# EAGLE design shield-v1.2 (EAGLE 8.2.0)
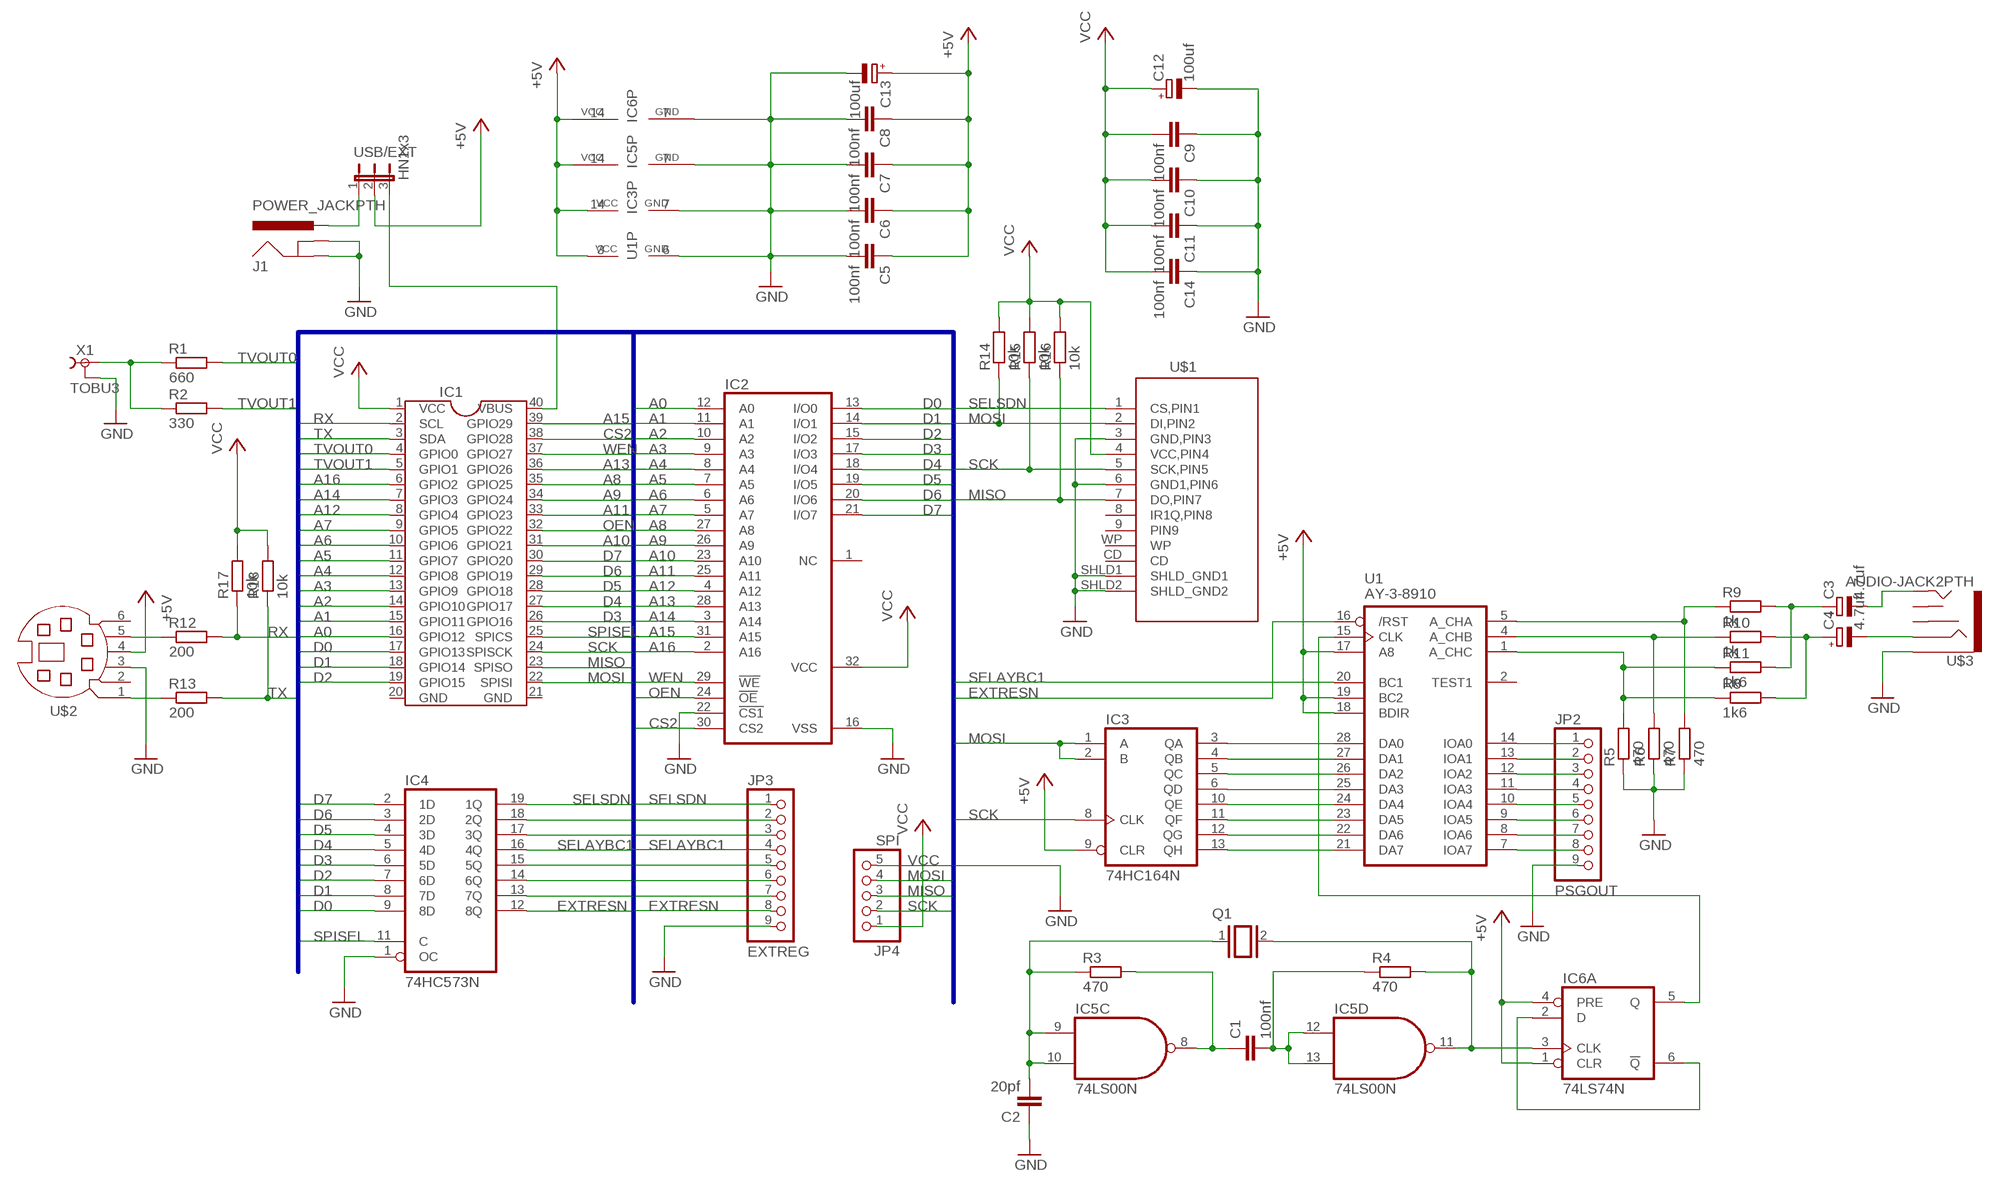
[diagram p0: schematic, sheet 1]

## Parts
C1  100nf  CAP1206  [1206]
C2  20pf  CAP1206  [1206]
C3  4.7uf  CPOL-EUE5-5  [E5-5]
C4  4.7uf  CPOL-EUE5-5  [E5-5]
C5  100nf  CAP1206  [1206]
C6  100nf  CAP1206  [1206]
C7  100nf  CAP1206  [1206]
C8  100nf  CAP1206  [1206]
C9  100nf  CAP1206  [1206]
C10  100nf  CAP1206  [1206]
C11  100nf  CAP1206  [1206]
C12  100uf  CPOL-EUE5-5  [E5-5]
C13  100uf  CPOL-EUE5-5  [E5-5]
C14  100nf  CAP1206  [1206]
IC1  STEPFPGA  [DIL40]
IC2  628128P  [DIL32]
IC3  74HC164N  [DIL14]
IC4  74HC573N  [DIL20]
IC5  74LS00N  [DIL14]
IC6  74LS74N  [DIL14]
J1  POWER_JACKPTH  [POWER_JACK_PTH]
JP2  PSGOUT  PINHD-1X9  [1X09]
JP3  EXTREG  PINHD-1X9  [1X09]
JP4  SPI  PINHD-1X5  [1X05]
Q1  XTAL/S  [QS]
R1  660  R-EU_R1206  [R1206]
R2  330  R-EU_R1206  [R1206]
R3  470  R-EU_R1206  [R1206]
R4  470  R-EU_R1206  [R1206]
R5  470  R-EU_R1206  [R1206]
R6  470  R-EU_R1206  [R1206]
R7  470  R-EU_R1206  [R1206]
R8  1k6  R-EU_R1206  [R1206]
R9  1k  R-EU_R1206  [R1206]
R10  1k  R-EU_R1206  [R1206]
R11  1k6  R-EU_R1206  [R1206]
R12  200  R-EU_R1206  [R1206]
R13  200  R-EU_R1206  [R1206]
R14  10k  R-EU_R1206  [R1206]
R15  10k  R-EU_R1206  [R1206]
R16  10k  R-EU_R1206  [R1206]
R17  10k  R-EU_R1206  [R1206]
R18  10k  R-EU_R1206  [R1206]
U1  AY-3-8910  [DIL28-6]
U$1  FCI_SD_SOCKET  [SD-MMC_SOCKET-PP]
U$2  MD06SS  [MDIN06SS]
U$3  AUDIO-JACK2PTH  [AUDIO-JACK]
USB/EXT  HN1x3  JP2E  [JP2]
X1  TOBU3  [TOBU3]

## Nets
+5V: C5.1 C6.1 C7.1 C8.1 C13.+ IC3.9(CLR) IC3.14(VCC) IC5.14(P:VCC) IC6.1(A:CLR) IC6.4(A:PRE) IC6.14(P:VCC) U1.3(VCC) U1.17(A8) U1.18(BDIR) U1.19(BC2) U$2.4 USB/EXT.2
A0: IC1.16(GPIO12) IC2.12(A0)
A1: IC1.15(GPIO11) IC2.11(A1)
A2: IC1.14(GPIO10) IC2.10(A2)
A3: IC1.13(GPIO9) IC2.9(A3)
A4: IC1.12(GPIO8) IC2.8(A4)
A5: IC1.11(GPIO7) IC2.7(A5)
A6: IC1.10(GPIO6) IC2.6(A6)
A7: IC1.9(GPIO5) IC2.5(A7)
A8: IC1.35(GPIO25) IC2.27(A8)
A9: IC1.34(GPIO24) IC2.26(A9)
A10: IC1.31(GPIO21) IC2.23(A10)
A11: IC1.33(GPIO23) IC2.25(A11)
A12: IC1.8(GPIO4) IC2.4(A12)
A13: IC1.36(GPIO26) IC2.28(A13)
A14: IC1.7(GPIO3) IC2.3(A14)
A15: IC1.39(GPIO29) IC2.31(A15)
A16: IC1.6(GPIO2) IC2.2(A16)
CS2: IC1.38(GPIO28) IC2.30(CS2)
D0: IC1.17(GPIO13) IC2.13(I/O0) IC4.9(8D)
D1: IC1.18(GPIO14) IC2.14(I/O1) IC4.8(7D)
D2: IC1.19(GPIO15) IC2.15(I/O2) IC4.7(6D)
D3: IC1.26(GPIO16) IC2.17(I/O3) IC4.6(5D)
D4: IC1.27(GPIO17) IC2.18(I/O4) IC4.5(4D)
D5: IC1.28(GPIO18) IC2.19(I/O5) IC4.4(3D)
D6: IC1.29(GPIO19) IC2.20(I/O6) IC4.3(2D)
D7: IC1.30(GPIO20) IC2.21(I/O7) IC4.2(1D)
EXTRESN: IC4.12(8Q) JP3.8 U1.16(/RST)
GND: C2.1 C5.2 C6.2 C7.2 C8.2 C9.1 C10.1 C11.1 C12.- C13.- C14.1 IC2.16(VSS) IC2.22(!CS1) IC3.7(GND) IC4.1(OC) IC5.7(P:GND) IC6.7(P:GND) J1.GND J1.GNDBREAK JP2.9 JP3.9 JP4.5 R5.1 R6.1 R7.1 U1.6(GND) U$1.3(GND,PIN3) U$1.6(GND1,PIN6) U$1.SHLD1(SHLD_GND1) U$1.SHLD2(SHLD_GND2) U$2.3 U$3.SLEEVE X1.2 X1.2@1 X1.2@2
MISO: IC1.23(SPISO) JP4.3 R16.1 U$1.7(DO,PIN7)
MOSI: IC1.22(SPISI) IC3.1(A) IC3.2(B) JP4.4 R14.1 U$1.2(DI,PIN2)
N$1: R1.1 R2.1 X1.1
N$2: IC3.3(QA) U1.28(DA0)
N$3: IC3.4(QB) U1.27(DA1)
N$4: IC3.5(QC) U1.26(DA2)
N$5: IC3.6(QD) U1.25(DA3)
N$6: IC3.10(QE) U1.24(DA4)
N$7: IC3.11(QF) U1.23(DA5)
N$8: IC3.12(QG) U1.22(DA6)
N$9: IC3.13(QH) U1.21(DA7)
N$10: R5.2 R8.1 R11.1 U1.1(A_CHC)
N$11: C1.1 IC5.8(C:O) R3.2
N$12: C1.2 IC5.12(D:I0) IC5.13(D:I1) R4.1
N$13: C2.2 IC5.9(C:I0) IC5.10(C:I1) Q1.1 R3.1
N$14: IC5.11(D:O) IC6.3(A:CLK) Q1.2 R4.2
N$15: R6.2 R10.1 U1.4(A_CHB)
N$16: IC6.2(A:D) IC6.6(A:!Q)
N$17: IC6.5(A:Q) U1.15(CLK)
N$18: R7.2 R9.1 U1.5(A_CHA)
N$19: C4.+ R8.2 R10.2
N$20: C3.+ R9.2 R11.2
N$21: C3.- U$3.TIP
N$22: C4.- U$3.RING
N$23: R12.1 U$2.5
N$24: R13.1 U$2.1
N$25: JP2.1 U1.14(IOA0)
N$26: JP2.2 U1.13(IOA1)
N$27: JP2.3 U1.12(IOA2)
N$28: JP2.4 U1.11(IOA3)
N$29: JP2.5 U1.10(IOA4)
N$30: JP2.6 U1.9(IOA5)
N$31: JP2.7 U1.8(IOA6)
N$32: JP2.8 U1.7(IOA7)
N$33: IC4.18(2Q) JP3.2
N$34: IC4.17(3Q) JP3.3
N$35: IC4.15(5Q) JP3.5
N$36: IC4.14(6Q) JP3.6
N$37: IC4.13(7Q) JP3.7
N$38: J1.PWR USB/EXT.1
N$39: IC1.40(VBUS) USB/EXT.3
OEN: IC1.32(GPIO22) IC2.24(!OE)
RX: IC1.2(SCL) R12.2 R17.1
SCK: IC1.24(SPISCK) IC3.8(CLK) JP4.2 R15.1 U$1.5(SCK,PIN5)
SELAYBC1: IC4.16(4Q) JP3.4 U1.20(BC1)
SELSDN: IC4.19(1Q) JP3.1 U$1.1(CS,PIN1)
SPISEL: IC1.25(SPICS) IC4.11(C)
TVOUT0: IC1.4(GPIO0) R1.2
TVOUT1: IC1.5(GPIO1) R2.2
TX: IC1.3(SDA) R13.2 R18.1
VCC: C9.2 C10.2 C11.2 C12.+ C14.2 IC1.1(VCC) IC2.32(VCC) JP4.1 R14.2 R15.2 R16.2 R17.2 R18.2 U$1.4(VCC,PIN4)
WEN: IC1.37(GPIO27) IC2.29(!WE)
Unconnected: IC2.1(NC) IC5.1(A:I0) IC5.2(A:I1) IC5.3(A:O) IC5.4(B:I0) IC5.5(B:I1) IC5.6(B:O) IC6.8(B:!Q) IC6.9(B:Q) IC6.10(B:PRE) IC6.11(B:CLK) IC6.12(B:D) IC6.13(B:CLR) U1.2(TEST1) U$1.8(IR1Q,PIN8) U$1.9(PIN9) U$1.CD U$1.WP U$2.2 U$2.6 U$3.RSH U$3.TSH

## Buses
A[0..16],D[0..7],WEN,OEN,CS2,RX,TX,TVOUT[0..1],SPISEL,MISO,MOSI,SCK,SELSDN,SELAYBC1,EXTRESN

## Power pins joined to a net without a drawn wire
GND: IC1.20(GND) IC1.21(GND) IC4.10(GND)
VCC: IC4.20(VCC)

## Library data of the parts
C1 C2 C5-C11 C14 = SparkFun:CAP: Capacitor Standard 0603 ceramic capacitor, and 0.1" leaded capacitor.
C3 C4 C12 C13 = rcl:CPOL-EU: POLARIZED CAPACITOR, European symbol
IC1 = stepfpga:STEPFPGA: StepFPGA module
IC2 = memory-hitachi:628128P: MEMORY; OC_FARNELL: unknown; OC_NEWARK: unknown
IC3 = 74xx-eu:74*164: 8-bit parallel out SHIFT REGISTER
IC4 = 74xx-eu:74*573: 8-bit D latch BUS DRIVER
IC5 = 74xx-us:74*00: Quad 2-input NAND gate
IC6 = 74xx-us:74*74: Dual D type positive edge triggered FLIP FLOP, preset and clear
J1 = SparkFun:POWER_JACK: Power Jack This is the standard 5.5mm barrel jack for power. The PTH is the most common, proven, reliable, footprint. All others are experimental. The Slot footprint only works if the mill layer is transmitted to the PCB fab house so be warned. Spark Fun Electronics SKU : PRT-00119. Mating wall wart : TOL-00298 (and others)
JP2 JP3 = pinhead:PINHD-1X9: PIN HEADER
JP4 = pinhead:PINHD-1X5: PIN HEADER
Q1 = special:XTAL/S: CRYSTAL
R1-R18 = resistor:R-EU_: RESISTOR, European symbol
U1 = oldchips:AY-3-8910: Programmable sound generator
U$1 = stepfpga:FCI_SD_SOCKET: FCI Memory Card Connector (SD card); MF: FCI; MOUSER: 649-10067847-001RLF; MPN: 10067847-001RLF
U$2 = con-yamaichi:MD06SS: YAMAICHI CONNECTOR; OC_FARNELL: unknown; OC_NEWARK: unknown
U$3 = SparkFun:AUDIO-JACK2
USB/EXT = jumper:JP2E: JUMPER
X1 = con-hirschmann:TOBU3: Female Cinch CONNECTOR ( RCA Jack ); MF: FARNELL; MPN: TOBU 3; OC_FARNELL: 592791; OC_NEWARK: 06WX5914

## Board
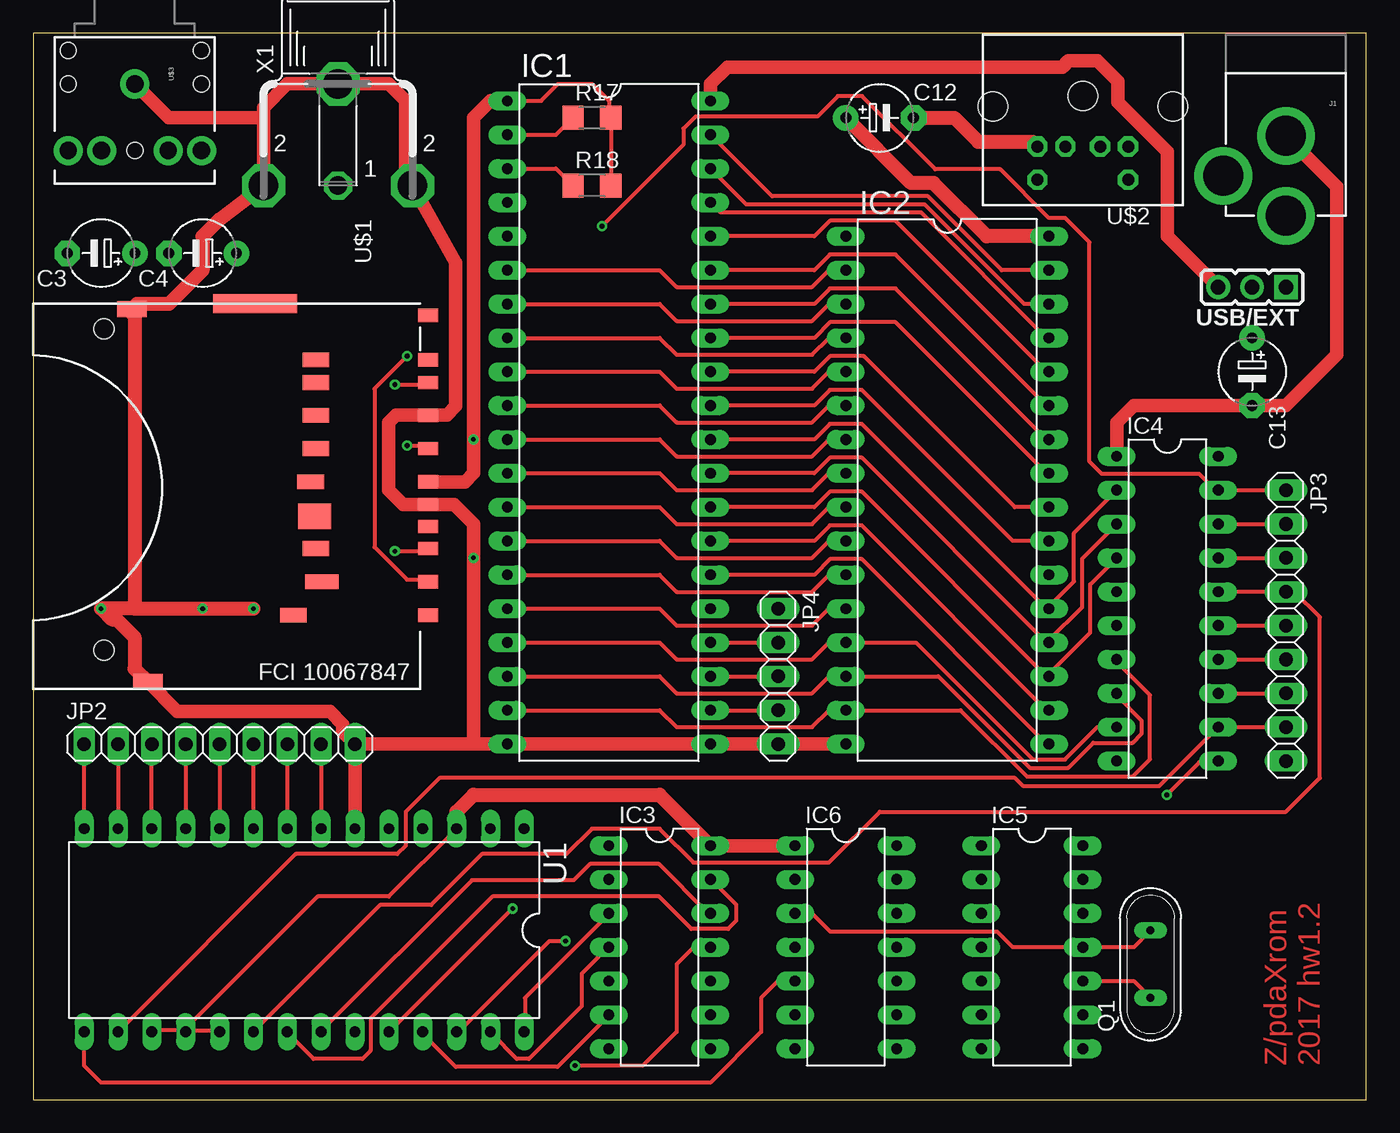
[diagram p1: board, top side]
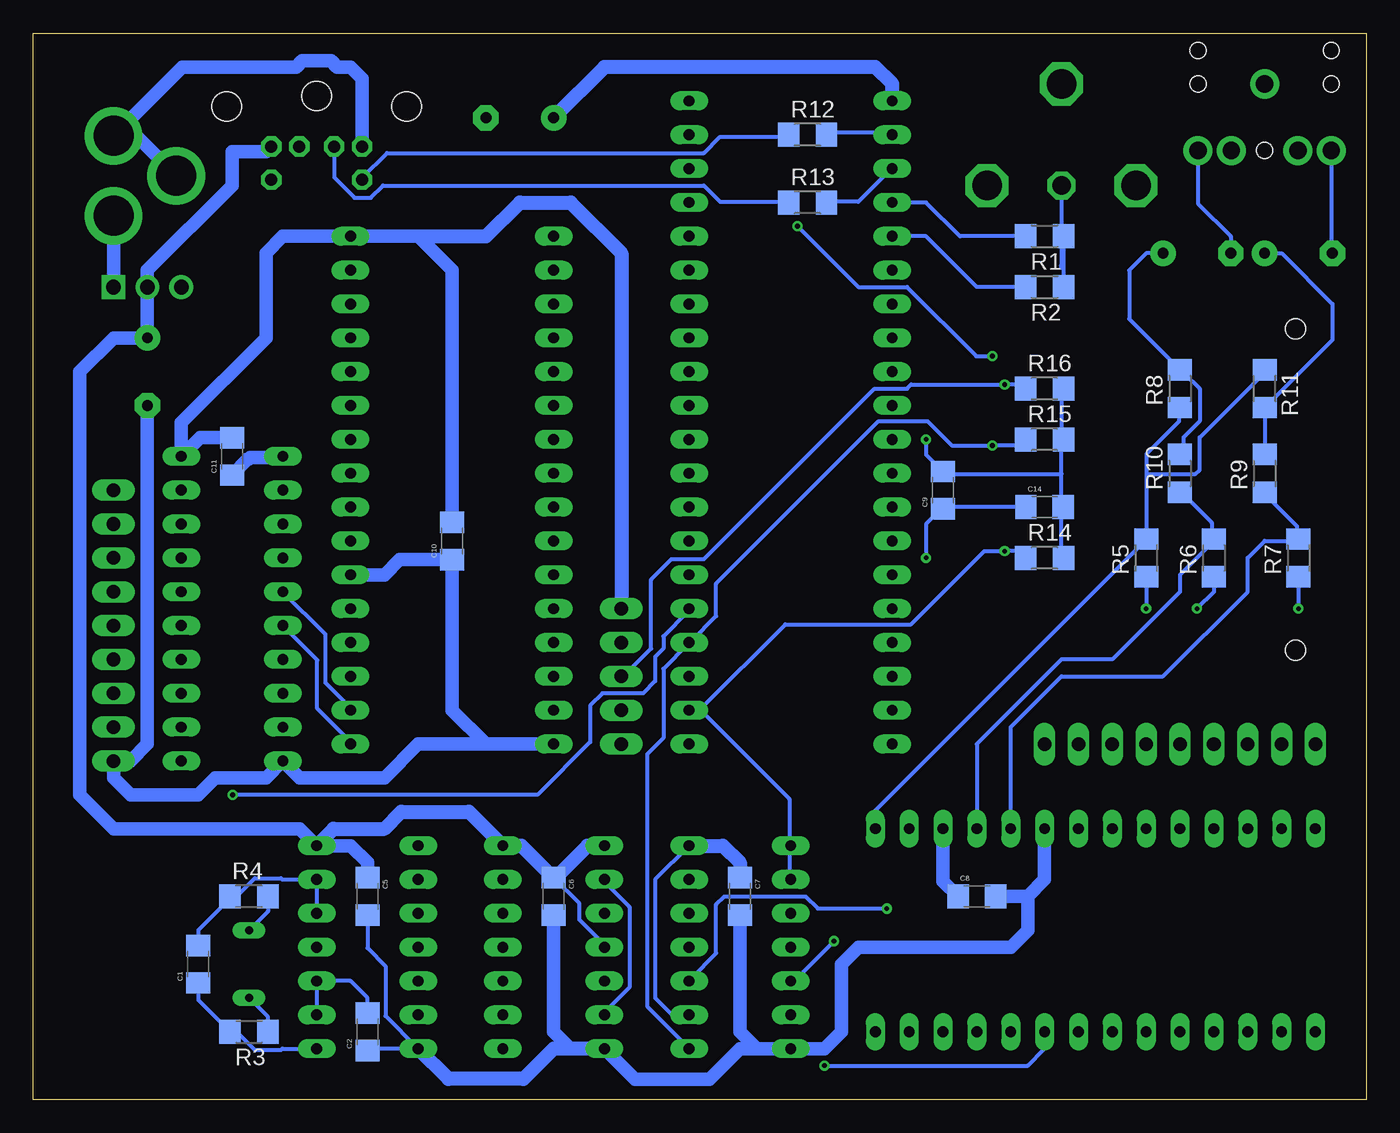
[diagram p2: board, bottom side, seen from below]

Size 100 x 80 mm. Coordinates in mm from the lower left corner, seen from the top.
Outline: 0,0 100,0 100,80 0,80 0,0
Copper layers (1*16): Top 0.035mm / dielectric 1.5mm / Bottom 0.035mm
Design rules "default *": minimum track width 12mil, minimum drill 0.35mm, track to track 12mil, track to pad 12mil, pad to pad 12mil, via to via 12mil, smd to smd 12mil, copper to edge 40mil, drill to drill 12mil, minimum pad ring 12mil, minimum via ring 8mil, stop-mask expansion 4mil, vias tented up to drill 0mil, thermal gap 10mil

### Footprints (pad centres in the part's own frame; a part is rotated, then mirrored left to right if it is on the bottom)
1206 = smd 1.6 x 1.8: 1 -1.4,0; 2 1.4,0
E5-5 = drill 0.813 pad 1.905: + -2.54,0 | drill 0.813 pad 1.905 octagon: - 2.54,0
DIL40 = drill 0.813 long: 1 -24.13,-7.62; 2 -21.59,-7.62; 3 -19.05,-7.62; 4 -16.51,-7.62; 5 -13.97,-7.62; 6 -11.43,-7.62; 7 -8.89,-7.62; 8 -6.35,-7.62; 9 -3.81,-7.62; 10 -1.27,-7.62; 11 1.27,-7.62; 12 3.81,-7.62; 13 6.35,-7.62; 14 8.89,-7.62; 15 11.43,-7.62; 16 13.97,-7.62; 17 16.51,-7.62; 18 19.05,-7.62; 19 21.59,-7.62; 20 24.13,-7.62; 21 24.13,7.62; 22 21.59,7.62; 23 19.05,7.62; 24 16.51,7.62; 25 13.97,7.62; 26 11.43,7.62; 27 8.89,7.62; 28 6.35,7.62; 29 3.81,7.62; 30 1.27,7.62; 31 -1.27,7.62; 32 -3.81,7.62; 33 -6.35,7.62; 34 -8.89,7.62; 35 -11.43,7.62; 36 -13.97,7.62; 37 -16.51,7.62; 38 -19.05,7.62; 39 -21.59,7.62; 40 -24.13,7.62
DIL32 = drill 0.813 long: 1 -19.05,-7.62; 2 -16.51,-7.62; 3 -13.97,-7.62; 4 -11.43,-7.62; 5 -8.89,-7.62; 6 -6.35,-7.62; 7 -3.81,-7.62; 8 -1.27,-7.62; 9 1.27,-7.62; 10 3.81,-7.62; 11 6.35,-7.62; 12 8.89,-7.62; 13 11.43,-7.62; 14 13.97,-7.62; 15 16.51,-7.62; 16 19.05,-7.62; 17 19.05,7.62; 18 16.51,7.62; 19 13.97,7.62; 20 11.43,7.62; 21 8.89,7.62; 22 6.35,7.62; 23 3.81,7.62; 24 1.27,7.62; 25 -1.27,7.62; 26 -3.81,7.62; 27 -6.35,7.62; 28 -8.89,7.62; 29 -11.43,7.62; 30 -13.97,7.62; 31 -16.51,7.62; 32 -19.05,7.62
DIL14 = drill 0.813 long: 1 -7.62,-3.81; 2 -5.08,-3.81; 3 -2.54,-3.81; 4 0,-3.81; 5 2.54,-3.81; 6 5.08,-3.81; 7 7.62,-3.81; 8 7.62,3.81; 9 5.08,3.81; 10 2.54,3.81; 11 0,3.81; 12 -2.54,3.81; 13 -5.08,3.81; 14 -7.62,3.81
DIL20 = drill 0.813 long: 1 -11.43,-3.81; 2 -8.89,-3.81; 3 -6.35,-3.81; 4 -3.81,-3.81; 5 -1.27,-3.81; 6 1.27,-3.81; 7 3.81,-3.81; 8 6.35,-3.81; 9 8.89,-3.81; 10 11.43,-3.81; 11 11.43,3.81; 12 8.89,3.81; 13 6.35,3.81; 14 3.81,3.81; 15 1.27,3.81; 16 -1.27,3.81; 17 -3.81,3.81; 18 -6.35,3.81; 19 -8.89,3.81; 20 -11.43,3.81
POWER_JACK_PTH = drill 2.997 pad 4.318: GND 0,7.7; GNDBREAK 4.7,10.7; PWR 0,13.7
1X09 = drill 1.016 long: 1 -10.16,0; 2 -7.62,0; 3 -5.08,0; 4 -2.54,0; 5 0,0; 6 2.54,0; 7 5.08,0; 8 7.62,0; 9 10.16,0
1X05 = drill 1.016 long: 1 -5.08,0; 2 -2.54,0; 3 0,0; 4 2.54,0; 5 5.08,0
QS = drill 0.61 long: 1 -2.54,0; 2 2.54,0
R1206 = smd 1.6 x 1.803: 1 -1.422,0; 2 1.422,0
DIL28-6 = drill 0.813 long: 1 -16.51,-7.62; 2 -13.97,-7.62; 3 -11.43,-7.62; 4 -8.89,-7.62; 5 -6.35,-7.62; 6 -3.81,-7.62; 7 -1.27,-7.62; 8 1.27,-7.62; 9 3.81,-7.62; 10 6.35,-7.62; 11 8.89,-7.62; 12 11.43,-7.62; 13 13.97,-7.62; 14 16.51,-7.62; 15 16.51,7.62; 16 13.97,7.62; 17 11.43,7.62; 18 8.89,7.62; 19 6.35,7.62; 20 3.81,7.62; 21 1.27,7.62; 22 -1.27,7.62; 23 -3.81,7.62; 24 -6.35,7.62; 25 -8.89,7.62; 26 -11.43,7.62; 27 -13.97,7.62; 28 -16.51,7.62
SD-MMC_SOCKET-PP = smd 1 x 1.5: 1 6.875,29.6; 2 4.375,29.6; 3 1.075,29.6; 4 -0.625,29.6; 5 -3.125,29.6; 6 -5.625,29.6; 7 -8.075,29.6; 8 -9.775,29.6; 9 9.375,29.6; CD 2.725,29.6; WP -13.125,29.6 | smd 1.4 x 6.3: 14 -14,16.65 | smd 1.2 x 2.2: SHLD1 -13.6,7.4; SHLD2 14.4,8.6 | smd 1.1 x 2: SW -9.775,21.2; SW1 -8.075,21.2; SW2 -5.625,21.2; SW3 -3.125,21.2; SW4 -0.625,20.8; SW6 4.375,21.2; SW8 9.375,19.5 | smd 1.9 x 2.5: SW5 1.95,21.1 | smd 1.1 x 2.5: SW7 6.875,21.65 | hole 1.5: -12.1,5.3; 12,5.3
MDIN06SS = drill 0.9 octagon: 1 1.3,8.5; 2 -1.3,8.5; 3 3.4,8.5; 4 -3.4,8.5; 5 3.4,11; 6 -3.4,11 | hole 2.2: -6.75,5.5; 0,4.7; 6.75,5.5
AUDIO-JACK = drill 1.3 pad 2.184: RING 5,5; RSH 5,2.5; SLEEVE 0,0; TIP 5,-5; TSH 5,-2.5 | hole 1.2: 0,5; -2.5,5; -2.5,-5; 0,-5; 5,0
JP2 = drill 1.1 pad 1.778 square: 1 -2.54,0 | drill 1.1 pad 1.778: 2 0,0; 3 2.54,0
TOBU3 = drill 1.397 octagon: 1 0,-2.54 | drill 2.21 octagon: 2 5.588,-2.54; 2@1 -5.588,-2.54; 2@2 0,5.08

### Placement (x,y rotation side)
C1  87.63,10.16 90 bottom
C2  74.93,5.08 90 bottom
C3  5.08,63.5 180 top
C4  12.7,63.5 180 top
C5  74.93,15.24 270 bottom
C6  60.96,15.24 270 bottom
C7  46.99,15.24 270 bottom
C8  29.21,15.24 0 bottom
C9  31.75,45.72 90 bottom
C10  68.58,41.91 90 bottom
C11  85.09,48.26 90 bottom
C12  63.5,73.66 0 top
C13  91.44,54.61 270 top
C14  24.13,44.45 0 bottom
IC1  43.18,50.8 270 top
IC2  68.58,45.72 270 top
IC3  46.99,11.43 270 top
IC4  85.09,36.83 270 top
IC5  74.93,11.43 270 top
IC6  60.96,11.43 270 top
J1  93.98,80.01 180 top
JP2  13.97,26.67 0 top
JP3  93.98,35.56 270 top
JP4  55.88,31.75 270 top
Q1  83.82,10.16 90 top
R1  24.13,64.77 180 bottom
R2  24.13,60.96 180 bottom
R3  83.82,5.08 180 bottom
R4  83.82,15.24 0 bottom
R5  16.51,40.64 90 bottom
R6  11.43,40.64 90 bottom
R7  5.08,40.64 90 bottom
R8  13.97,53.34 90 bottom
R9  7.62,46.99 90 bottom
R10  13.97,46.99 90 bottom
R11  7.62,53.34 270 bottom
R12  41.91,72.39 0 bottom
R13  41.91,67.31 0 bottom
R14  24.13,40.64 0 bottom
R15  24.13,49.53 0 bottom
R16  24.13,53.34 0 bottom
R17  41.91,73.66 0 top
R18  41.91,68.58 0 top
U1  20.32,12.7 180 top
U$1  0,45.72 270 top
U$2  78.74,80.01 180 top
U$3  7.62,76.2 270 top
USB/EXT  91.44,60.96 180 top
X1  22.86,71.12 0 top

### Tracks (layer width: path | path; a pad name or v marks a point on that pad's centre or on a via)
+5V
  Top 0.305: 11.28,5.18 9.14,5.18 U1.17 | 11.28,5.18 U1.18 11.58,5.18 13.72,5.18 U1.19 | U1.3 26.67,15.24 21.34,15.24 11.28,5.18
  Top 1.016: IC3.14 IC6.1
  Top 1.067: U1.3 31.75,21.59 33.02,22.86 46.99,22.86 IC3.14
  Bottom 0.305: IC6.4 57.15,11.61 59.03,13.49 59.03,14.71 C6.1 | IC3.14 53.34,16.51 53.34,7.62 52.07,6.35 IC3.9
  Bottom 1.016: U1.3 31.75,16.38 C8.1 | C5.1 74.93,17.78 76.2,19.05 IC5.14 80.01,20.32 93.98,20.32 96.52,22.86 96.52,54.61 93.98,57.15 C13.+ USB/EXT.2 91.44,62.23 85.09,68.58 85.09,71.12 82.53,71.12 U$2.4
  Bottom 1.067: IC5.14 77.47,20.32 73.66,20.32 72.39,21.59 67.31,21.59 IC6.14 63.37,19.05 C6.1 60.83,16.64 58.42,19.05 IC6.1 | IC3.14 48.26,19.05 46.99,17.78 C7.1
A0
  Top 0.305: IC1.16 46.99,36.83 48.26,35.56 58.42,35.56 59.69,36.83 IC2.12
A1
  Top 0.305: IC1.15 46.99,39.37 48.26,38.1 58.42,38.1 59.69,39.37 IC2.11
A2
  Top 0.305: IC1.14 46.99,41.91 48.26,40.64 58.42,40.64 59.69,41.91 IC2.10
A3
  Top 0.305: IC1.13 46.99,44.45 48.26,43.18 58.42,43.18 59.69,44.45 IC2.9
A4
  Top 0.305: IC1.12 46.99,46.99 48.26,45.72 58.42,45.72 59.69,46.99 IC2.8
A5
  Top 0.305: IC1.11 46.99,49.53 48.26,48.26 58.42,48.26 59.69,49.53 IC2.7
A6
  Top 0.305: IC1.10 46.99,52.07 48.26,50.8 58.42,50.8 59.69,52.07 IC2.6
A7
  Top 0.305: IC1.9 46.99,54.61 48.26,53.34 58.42,53.34 59.69,54.61 IC2.5
A8
  Top 0.305: IC1.35 58.6,62.23 59.77,63.4 64.69,63.4 76.02,52.07 IC2.27
A9
  Top 0.305: IC1.34 58.6,59.69 59.77,60.86 64.69,60.86 76.02,49.53 IC2.26
A10
  Top 0.305: IC2.23 73.48,41.91 62.16,53.24 59.77,53.24 58.6,52.07 IC1.31
A11
  Top 0.305: IC1.33 58.6,57.15 59.77,58.32 64.69,58.32 76.02,46.99 IC2.25
A12
  Top 0.305: IC1.8 46.99,57.15 48.26,55.88 58.42,55.88 59.69,57.15 IC2.4
A13
  Top 0.305: IC1.36 58.6,64.77 59.77,65.94 64.69,65.94 76.02,54.61 IC2.28
A14
  Top 0.305: IC1.7 46.99,59.69 48.26,58.42 58.42,58.42 59.69,59.69 IC2.3
A15
  Top 0.305: IC2.31 72.67,62.23 67.13,67.77 55.42,67.77 IC1.39
A16
  Top 0.305: IC1.6 46.99,62.23 48.26,60.96 58.42,60.96 59.69,62.23 IC2.2
CS2
  Top 0.305: IC2.30 74.35,59.69 66.88,67.16 53.49,67.16 IC1.38
D0
  Top 0.305: IC1.17 46.99,34.29 48.26,33.02 58.42,33.02 59.69,34.29 IC2.13 66.22,34.29 75,25.5 77.39,25.5 79.83,27.94 IC4.9
D1
  Top 0.305: IC1.18 46.99,31.75 48.26,30.48 58.42,30.48 59.69,31.75 IC2.14 67.89,31.75 74.75,24.89 77.65,24.89 79.53,26.77 82.47,26.77 83.16,27.46 83.16,28.42 81.28,30.3 IC4.8
D2
  Top 0.305: IC1.19 46.99,29.21 48.26,27.94 58.42,27.94 59.69,29.21 IC2.15 69.57,29.21 74.55,24.23 82.47,24.23 83.77,25.53 83.77,30.35 81.28,32.84 IC4.7
D3
  Top 0.305: IC1.26 58.6,39.37 59.77,40.54 62.16,40.54 76.02,26.67 IC2.17
  Bottom 0.305: IC4.6 78.69,32.97 78.69,29.34 76.2,26.85 IC2.17
D4
  Top 0.305: IC1.27 58.6,41.91 59.77,43.08 62.16,43.08 76.02,29.21 IC2.18
  Bottom 0.305: IC2.18 76.2,29.39 78.08,31.27 78.08,34.9 IC4.5
D5
  Top 0.305: IC1.28 58.6,44.45 59.77,45.62 62.16,45.62 76.02,31.75 IC2.19 76.2,31.93 79.3,35.02 79.3,38.66 IC4.4
D6
  Top 0.305: IC1.29 58.6,46.99 59.77,48.16 62.16,48.16 76.02,34.29 IC2.20 76.2,34.47 78.69,36.96 78.69,40.59 IC4.3
D7
  Top 0.305: IC1.30 58.6,49.53 59.77,50.7 62.16,50.7 76.02,36.83 IC2.21 76.2,37.01 78.08,38.89 78.08,42.52 IC4.2
EXTRESN
  Top 0.305: U1.16 19.68,18.41 27.3,18.41 27.94,19.05 27.94,21.59 30.48,24.13 73.66,24.13 74.3,23.5 84.45,23.5 IC4.12 JP3.8
GND  (via drill 0.35)
  Top 0.305: U$1.SHLD1 7.62,58.83
  Top 1.016: U1.6 JP2.9 | 33.02,26.67 JP2.9 | 33.02,26.67 IC1.20 IC1.21 JP4.5 IC2.16 | J1.GND 97.79,68.5 97.79,55.88 93.98,52.07 C13.- 82.55,52.07 81.28,50.8 IC4.1 | U$1.SHLD2 10.81,29.11 22.26,29.11 23.22,28.16 23.22,27.58 JP2.9 | 33.02,26.67 v33.02,40.64 33.02,43.18 31.55,44.65 U$1.3 27.75,44.65 26.67,45.72 26.67,50.8 27.21,51.34 U$1.6 31.02,51.34 31.7,52.02 31.7,62.79 X1.2 27.94,69.09 27.94,74.93 26.67,76.2 X1.2@2 19.05,76.2 17.27,74.42 17.27,73.66 | 17.27,73.66 X1.2@1 | U$3.SLEEVE 10.16,73.66 17.27,73.66
  Top 1.067: C12.- 69.09,73.66 70.89,71.86 74.99,71.86 U$2.3 | v16.51,36.83 v12.7,36.83 7.62,36.83 | 7.62,36.83 v5.08,36.83 5.89,36.02 6.25,36.02 7.6,34.67 7.6,32.32 U$1.SHLD2 | 7.62,36.83 7.6,36.85 7.6,58.77 7.4,58.97 U$1.SHLD1 7.77,59.69 10.16,59.69 12.7,62.23 12.7,64.77 13.97,66.04 X1.2@1
  Bottom 0.305: C5.2 74.93,11.37 73.57,10.01 73.57,6.26 IC5.7 74.8,3.81 C2.1 | v33.02,40.64 33.02,43.18 31.88,44.32 C9.1 31.7,44.5 25.6,44.5 C14.1 | R7.1 v5.08,36.83 | R6.1 11.43,38.1 v12.7,36.83 | R5.1 v16.51,36.83
  Bottom 1.016: U1.6 24.13,16.51 25.4,15.24 | 25.4,15.24 C8.2 | C6.2 60.96,5.08 59.69,3.81 IC6.7 54.86,1.52 49.28,1.52 46.99,3.81 IC3.7 | IC3.7 40.64,3.81 39.37,5.08 39.37,10.16 38.1,11.43 26.67,11.43 25.4,12.7 25.4,15.24 | IC2.16 66.04,26.67 | 66.04,26.67 68.58,29.21 C10.1 72.52,40.51 73.66,39.37 IC2.22 | 66.04,26.67 71.12,26.67 73.66,24.13 80.01,24.13 IC4.10 82.55,24.13 86.36,24.13 87.63,22.86 92.71,22.86 93.98,24.13 JP3.9 92.71,25.4 91.44,26.67 C13.- | IC3.7 45.72,3.81 46.99,5.08 C7.2 | U$2.3 75.34,76.61 76.2,77.47 77.19,77.47 77.65,77.93 79.83,77.93 80.29,77.47 88.82,77.47 J1.GND 92.28,72.31 J1.GNDBREAK | C11.1 83.9,48.05 83.85,48.05 83.73,48.17 81.37,48.17 IC4.1
  Bottom 1.067: IC6.7 60.96,3.81 63.22,1.55 68.86,1.55 IC5.7
MISO  (via drill 0.35)
  Top 0.305: IC1.23 JP4.3 | v27.13,53.65 29.57,53.65 U$1.7
  Bottom 0.305: R16.1 25.6,53.34 25.91,53.65 v27.13,53.65 34.14,53.65 34.44,53.34 36.88,53.34 49.68,40.54 52.12,40.54 53.65,39.01 53.65,33.83 55.78,31.7 JP4.3
MOSI  (via drill 0.35)
  Top 0.305: IC1.22 JP4.4 | v27.13,41.15 29.57,41.15 U$1.2
  Bottom 0.305: IC3.2 43.28,16.76 43.28,18.9 IC3.1 43.28,19.2 43.28,22.55 49.99,29.26 | R14.1 25.6,40.84 25.91,41.15 v27.13,41.15 28.65,41.15 34.14,35.66 43.59,35.66 49.99,29.26 | 49.99,29.26 50.6,29.26 IC1.22 49.99,29.26
N$1
  Bottom 0.305: X1.1 22.86,62.38 R1.1 R2.1
N$2
  Top 0.305: U1.28 36.88,5.18 36.88,7.62 42.98,13.72 IC3.3
N$3
  Top 0.305: U1.27 34.44,4.88 36.27,3.05 37.19,3.05 41.15,7.01 41.15,9.45 42.98,11.28 IC3.4
N$4  (via drill 0.35)
  Top 0.305: v39.93,11.89 38.71,11.89 32,5.18 U1.26
  Bottom 0.305: v39.93,11.89 42.98,8.84 IC3.5
N$5
  Top 0.305: U1.25 29.26,4.88 31.7,2.44 39.32,2.44 42.98,6.1 IC3.6
N$6  (via drill 0.35)
  Top 0.305: v35.97,14.33 26.82,5.18 U1.24
  Bottom 0.305: v35.97,14.33 41.15,14.33 42.06,15.24 48.16,15.24 48.77,14.63 48.77,10.97 50.6,9.14 IC3.10
N$7  (via drill 0.35)
  Top 0.305: IC3.11 49.53,11.43 48.26,10.16 48.26,5.08 45.72,2.54 v40.64,2.54
  Bottom 0.305: v40.64,2.54 25.4,2.54 24.13,3.81 U1.23
N$8
  Top 0.305: U1.22 21.64,5.18 32.92,16.46 40.54,16.46 41.76,17.68 46.94,17.68 50.6,14.02 IC3.12
N$9
  Top 0.305: U1.21 19.2,4.88 21.03,3.05 24.69,3.05 25.3,3.66 25.3,6.1 34.44,15.24 46.94,15.24 49.38,12.8 52.12,12.8 52.73,13.41 52.73,14.63 50.9,16.46 IC3.13
N$10
  Bottom 0.305: 16.46,42.06 16.46,46.94 | 16.46,46.94 16.46,48.46 14.02,50.9 14.02,51.82 R8.1 | 16.46,42.06 R5.2 | 16.46,46.94 12.8,46.94 12.5,47.24 12.5,49.68 7.62,54.56 R11.1 | U1.1 36.83,21.69 16.46,42.06
N$11
  Bottom 0.305: C1.1 87.63,7.47 R3.2 84.75,5.08 83.39,3.72 81.41,3.72 81.32,3.81 IC5.8
N$12
  Bottom 0.305: IC5.12 IC5.13 81.32,16.51 81.41,16.6 83.39,16.6 84.9,15.09 85.24,15.09 | R4.1 85.24,15.09 | 85.24,15.09 87.63,12.7 C1.2
N$13
  Top 0.305: IC5.10 82.55,8.89 Q1.1
  Bottom 0.305: IC5.10 IC5.9 | 78.61,9.02 IC5.10 | C2.2 74.93,7.62 76.2,8.89 IC5.10 | R3.1 82.4,6.2 Q1.1
N$14
  Top 0.305: Q1.2 82.55,11.43 IC5.11 73.48,11.43 72.31,12.6 59.79,12.6 58.42,13.97 IC6.3
  Bottom 0.305: R4.2 82.4,14.12 Q1.2
N$15
  Bottom 0.305: R10.1 13.72,45.41 11.58,43.28 11.58,42.06 R6.2 11.43,41.91 13.97,39.37 13.97,38.1 19.05,33.02 22.86,33.02 29.21,26.67 U1.4
N$16
  Bottom 0.305: IC6.2 57.15,16.33 55.27,14.45 55.27,8.41 57.15,6.53 IC6.6
N$17
  Top 0.305: IC6.5 55.88,8.89 54.61,7.62 54.61,5.08 50.8,1.27 5.08,1.27 3.81,2.54 U1.15
N$18
  Bottom 0.305: 5.18,42.06 5.18,42.98 7.62,45.41 R9.1 | 5.18,42.06 R7.2 | U1.5 26.67,27.94 22.86,31.75 15.24,31.75 8.89,38.1 8.89,40.64 7.62,41.91 5.33,41.91 5.18,42.06
N$19
  Bottom 0.305: R10.2 13.72,48.46 13.72,49.68 12.5,50.9 12.5,53.34 13.72,54.56 R8.2 17.78,58.57 17.78,62.23 16.51,63.5 C4.+
N$20
  Bottom 0.305: R9.2 R11.2 2.54,57 2.54,59.69 6.35,63.5 C3.+
N$21
  Bottom 0.305: U$3.TIP 2.62,63.58 C3.-
N$22
  Bottom 0.305: U$3.RING 12.62,67.23 10.16,64.77 C4.-
N$23
  Bottom 0.305: R12.1 43.59,72.24 48.46,72.24 49.68,71.02 73.46,71.02 75.29,69.19 U$2.5
N$24
  Bottom 0.305: R13.1 43.59,67.36 48.46,67.36 49.68,68.58 73.76,68.58 74.68,67.67 75.89,67.67 77.42,69.19 77.42,71.32 U$2.1
N$25
  Top 0.305: U1.14 JP2.1
N$26
  Top 0.305: JP2.2 U1.13
N$27
  Top 0.305: U1.12 JP2.3
N$28
  Top 0.305: JP2.4 U1.11
N$29
  Top 0.305: JP2.5 U1.10
N$30
  Top 0.305: JP2.6 U1.9
N$31
  Top 0.305: JP2.7 U1.8
N$32
  Top 0.305: JP2.8 U1.7
N$33
  Top 0.305: IC4.18 JP3.2
N$34
  Top 0.305: IC4.17 JP3.3
N$35
  Top 0.305: IC4.15 JP3.5
N$36
  Top 0.305: IC4.14 JP3.6
N$37
  Top 0.305: IC4.13 JP3.7
N$38
  Bottom 1.016: USB/EXT.1 J1.PWR
N$39
  Top 1.016: IC1.40 50.8,76.2 52.07,77.47 77.19,77.47 77.65,77.93 79.83,77.93 81.36,76.4 81.36,74.85 85.09,71.12 85.09,64.77 USB/EXT.3
OEN
  Top 0.305: IC1.32 58.6,54.61 59.77,55.78 62.3,55.78 73.63,44.45 IC2.24
RX
  Top 0.305: IC1.2 39.22,72.39 R17.1
  Bottom 0.305: R12.2 40.23,72.54 35.66,72.54 IC1.2
SCK  (via drill 0.35)
  Top 0.305: IC1.24 JP4.2 | v28.04,49.07 29.57,49.07 U$1.5
  Bottom 0.305: R15.1 25.6,49.38 25.91,49.07 v28.04,49.07 31.09,49.07 32.92,50.9 36.58,50.9 48.77,38.71 48.77,36.27 50.6,34.44 IC1.24 50.9,34.14 52.73,32.31 52.73,27.13 53.95,25.91 53.95,7.01 50.9,3.96 IC3.8
SELAYBC1
  Top 0.305: 16.76,5.18 U1.20 26.04,14.61 29.84,14.61 33.66,18.41 40.01,18.41 41.91,20.32 46.99,20.32 49.53,17.78 59.69,17.78 63.5,21.59 93.98,21.59 96.52,24.13 96.52,36.2 94.61,38.1 JP3.4 IC4.16
SELSDN  (via drill 0.35)
  Top 0.305: JP3.1 IC4.19 88.7,45.72 87.48,46.94 80.16,46.94 79.25,47.85 79.25,64.31 77.42,66.14 76.2,66.14 72.54,69.8 67.67,69.8 62.18,75.29 60.35,75.29 58.83,73.76 49.68,73.76 48.77,72.85 48.77,71.63 v42.67,65.53 | v28.04,55.78 25.6,53.34 25.6,41.45 28.04,39.01 29.57,39.01 U$1.1
  Bottom 0.305: v28.04,55.78 29.26,55.78 34.44,60.96 38.1,60.96 v42.67,65.53
SPISEL  (via drill 0.35)
  Top 0.305: v85.04,22.86 87.48,25.3 88.7,25.3 IC4.11
  Bottom 0.305: v85.04,22.86 62.18,22.86 58.22,26.82 58.22,29.57 57.3,30.48 54.25,30.48 53.34,31.39 53.34,33.22 52.73,33.83 52.73,34.75 50.9,36.58 IC1.25
TVOUT0
  Bottom 0.305: R1.2 30.48,64.77 33.02,67.31 IC1.4
TVOUT1
  Bottom 0.305: R2.2 29.21,60.96 33.02,64.77 IC1.5
TX
  Top 0.305: IC1.3 39.22,69.85 R18.1
  Bottom 0.305: R13.2 40.23,67.36 38.1,67.36 35.66,69.8 IC1.3
VCC  (via drill 0.35)
  Top 0.305: IC1.1 38.1,74.93 39.37,76.2 41.91,76.2 43.18,74.93 43.18,73.81 R17.2 R18.2
  Top 1.016: IC1.1 34.29,74.93 33.02,73.66 v33.02,49.53 33.02,46.99 32.38,46.34 U$1.4
  Top 1.067: IC2.32 71.53,64.77 67.54,68.76 65.86,68.76 C12.+
  Bottom 0.305: v33.02,49.53 33.02,48.39 C9.2 31.7,46.94 22.86,46.94 | R16.2 22.86,53.34 22.86,49.68 R15.2 22.86,49.38 22.86,46.94 | R14.2 22.86,40.84 22.86,44.2 C14.2 22.86,44.5 22.86,46.94
  Bottom 1.016: C10.2 68.58,62.23 71.12,64.77 IC2.32 81.28,64.77 82.55,63.5 82.55,57.15 88.9,50.8 IC4.20 87.5,49.66 C11.2
  Bottom 1.067: 71.12,64.77 66.04,64.77 63.5,67.31 59.69,67.31 55.88,63.5 JP4.1 | IC1.1 35.56,76.2 36.83,77.47 57.15,77.47 C12.+
WEN
  Top 0.305: IC2.29 76.02,57.15 66.63,66.55 51.56,66.55 IC1.37

### Text on the board
Top: Z/pdaXrom / 2017 hw1.2